# Altium schematic sheet Speaker.SchDoc: SIM868 Development Board
size 199 x 149 mm; SheetNumber: 9; SheetTotal: 14
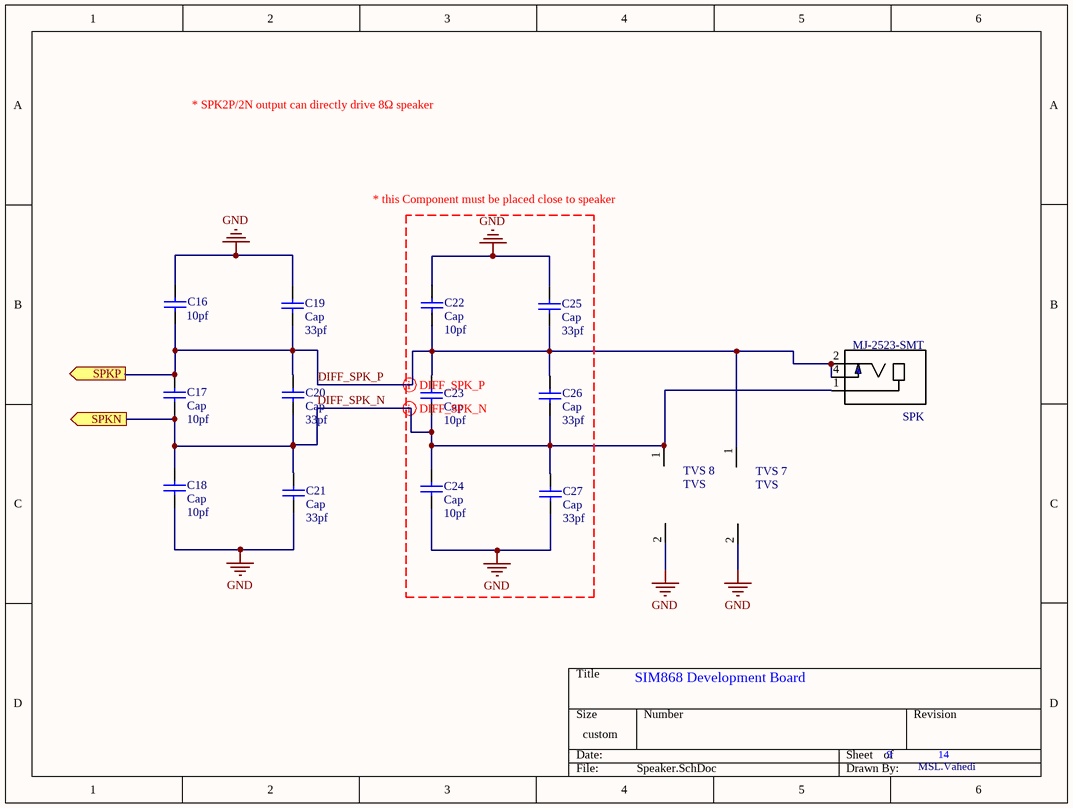
[diagram p0: Speaker.SchDoc]

## Parts
C16  value 10pf  [CAP0805]
C17  Cap  value 10pf  [CAP0805]
C18  Cap  value 10pf  [CAP0805]
C19  Cap  value 33pf  [CAP0805]
C20  Cap  value 33pf  [CAP0805]
C21  Cap  value 33pf  [CAP0805]
C22  Cap  value 10pf  [CAP0805]
C23  Cap  value 10pf  [CAP0805]
C24  Cap  value 10pf  [CAP0805]
C25  Cap  value 33pf  [CAP0805]
C26  Cap  value 33pf  [CAP0805]
C27  Cap  value 33pf  [CAP0805]
SPK  MJ-2523-SMT  [*CUI_MJ-2523-SMT]
TVS_7  TVS  [*FB_BLM18PG121SN1D]
TVS_8  TVS  [*FB_BLM18PG121SN1D]

## Ports
SPKN (out), SPKP (out)

## Nets
GND: C16.2 C18.1 C19.2 C21.1 C22.2 C24.1 C25.2 C27.1 TVS_7.2 TVS_8.2
DIFF_SPK_N: C17.1 C18.2 C20.1 C21.2 C23.1 C24.2 C26.1 C27.2 SPK.1(SLEEVE) TVS_8.1 ; port SPKN
DIFF_SPK_P: C16.1 C17.2 C19.1 C20.2 C22.1 C23.2 C25.1 C26.2 SPK.2(TIP) SPK.4(TIP_SWITCH) TVS_7.1 ; port SPKP

## Layout directives
differential pair; differential pair class SPKDIFF: DIFF_SPK_N, DIFF_SPK_P

## Notes on the sheet
- * SPK2P/2N output can directly drive 8Ω speaker
- * this Component must be placed close to speaker
- MSL.Vahedi

## Library data of the parts
C16-C27 = Cap: Capacitor; Published: 8-Jun-2000; LatestRevisionDate: 17-Jul-2002; LatestRevisionNote: Re-released for DXP Platform.; PackageReference: RAD-0.3; Publisher: Altium Limited; PackageDescription: Radial Cap, Thru-Hole; 2 Leads; 0.3 in Pin Spacing
SPK = MJ-2523-SMT: Value: *